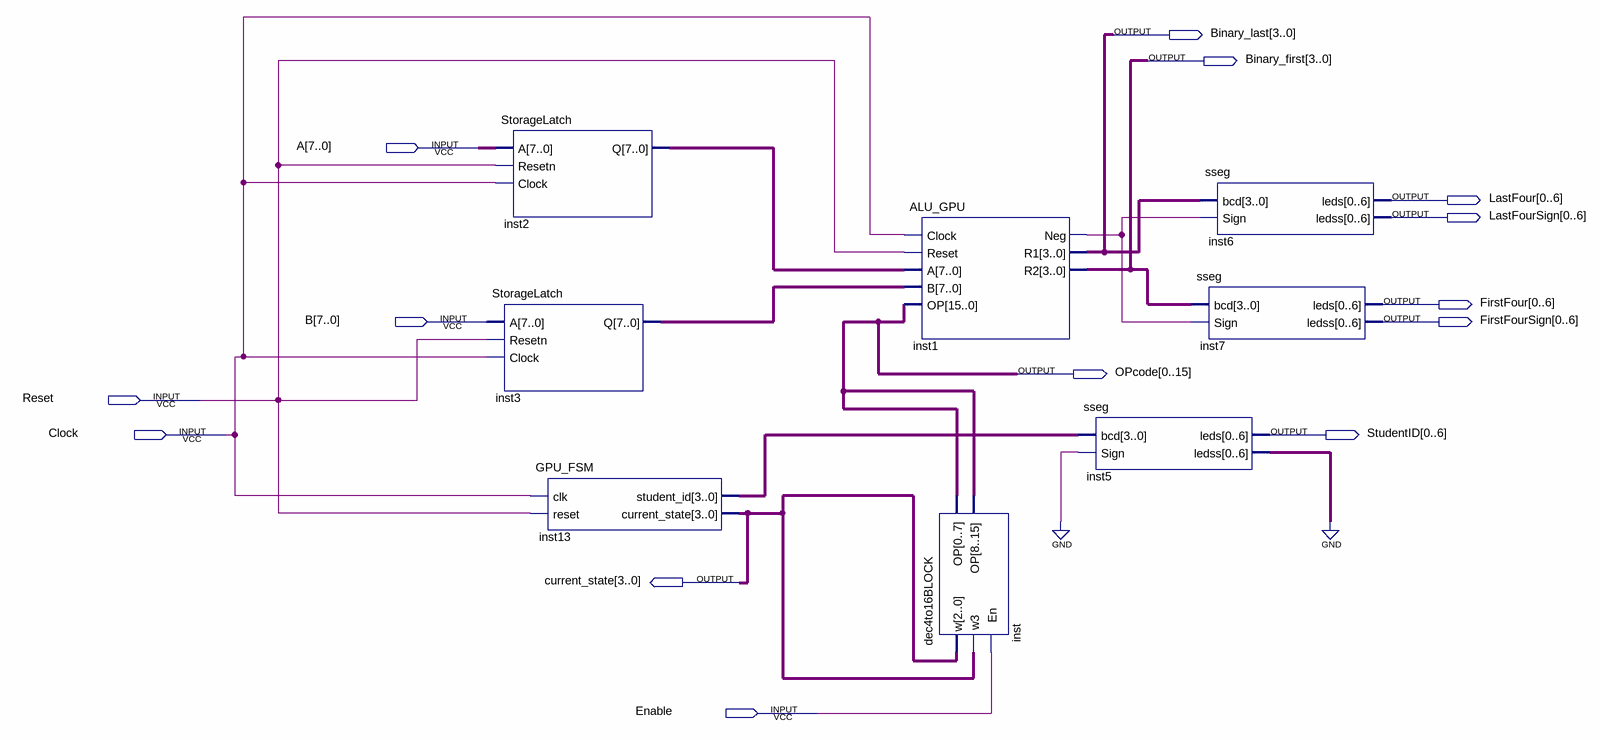
[diagram p0: schematic sheet]
// Quartus schematic GPU_BLOCK.bdf as structural Verilog: 8 symbols, 14 pins
module GPU_BLOCK (
  input  [7:0] A,
  input  [7:0] B,
  input  Reset,
  input  Clock,
  input  Enable,
  output [3:0] Binary_last,
  output [3:0] Binary_first,
  output [0:6] LastFour,
  output [0:6] LastFourSign,
  output [0:6] FirstFour,
  output [0:6] FirstFourSign,
  output [0:15] OPcode,
  output [0:6] StudentID,
  output [3:0] current_state
);

  wire inst1_neg;
  wire [3:0] inst13_student_id;
  wire [6:0] inst5_ledss;
  wire [7:0] inst2_q, inst3_q;

  StorageLatch inst2 (.A(A), .Resetn(Reset), .Clock(Clock), .Q(inst2_q));
  StorageLatch inst3 (.A(B), .Resetn(Reset), .Clock(Clock), .Q(inst3_q));
  GPU_FSM inst13 (.clk(Clock), .reset(Reset), .student_id(inst13_student_id), .current_state(current_state));
  ALU_GPU inst1 (
    .Clock(Clock), .Reset(Reset), .A(inst2_q), .B(inst3_q), .OP(OPcode), .Neg(inst1_neg), .R1(Binary_last),
    .R2(Binary_first));
  dec4to16BLOCK inst (
    .w(current_state[2:0]), .w3(current_state[3]), .En(Enable),
    .OP({OPcode[15], OPcode[14], OPcode[13], OPcode[12], OPcode[11], OPcode[10], OPcode[9], OPcode[8], OPcode[7], OPcode[6], OPcode[5], OPcode[4], OPcode[3], OPcode[2], OPcode[1], OPcode[0]}));
  sseg inst5 (.bcd(inst13_student_id), .Sign(1'b0), .leds(StudentID), .ledss(inst5_ledss));
  sseg inst6 (.bcd(Binary_last), .Sign(inst1_neg), .leds(LastFour), .ledss(LastFourSign));
  sseg inst7 (.bcd(Binary_first), .Sign(inst1_neg), .leds(FirstFour), .ledss(FirstFourSign));
  // also tied to GND on the sheet: {inst5_ledss[0], inst5_ledss[1], inst5_ledss[2], inst5_ledss[3], inst5_ledss[4], inst5_ledss[5], inst5_ledss[6]}

  // Other names for the same wires on the sheet: OP[15:0] = {OPcode[15], OPcode[14], OPcode[13], OPcode[12], OPcode[11], OPcode[10], OPcode[9], OPcode[8], OPcode[7], OPcode[6], OPcode[5], OPcode[4], OPcode[3], OPcode[2], OPcode[1], OPcode[0]}
endmodule
